# EAGLE design BQ32KSCH (EAGLE 9.2.2)
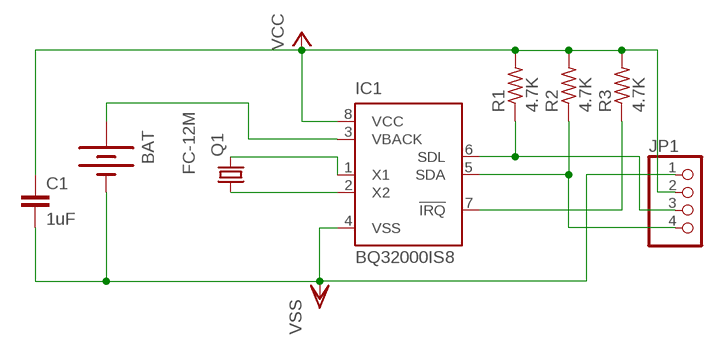
[diagram p0: schematic, sheet 1]

## Parts
BAT  CR1025-HOLDER  [CR1025-HOLDER]
C1  1uF  C-EUC3216  [C3216]
IC1  BQ32000IS8  [SO-08]
JP1  PINHD-1X4  [1X04]
Q1  FC-12M  [FC-12M]
R1  4.7K  R-US_R0402  [R0402]
R2  4.7K  R-US_R0402  [R0402]
R3  4.7K  R-US_R0402  [R0402]

## Nets
N$1: IC1.1(X1) Q1.2
N$2: IC1.2(X2) Q1.1
N$3: IC1.6(SDL) JP1.3 R1.1
N$4: IC1.5(SDA) JP1.4 R2.1
N$5: IC1.7(!IRQ) R3.1
N$6: BAT.PRWP1(PWRP) BAT.PWRP2(PWRP) IC1.3(VBACK)
VCC: C1.1 IC1.8(VCC) JP1.2 R1.2 R2.2 R3.2
VSS: BAT.PWRM1(PWRM) BAT.PWRM2(PWRM) C1.2 IC1.4(VSS) JP1.1

## Library data of the parts
BAT = CustomParts:CR1025-HOLDER
C1 = resistor:C-EU: CAPACITOR, European symbol
IC1 = CustomParts:BQ32000: 2-Wire RTC Real Time Clock/Calendar; OC_FARNELL: unknown; OC_NEWARK: unknown
JP1 = pinhead:PINHD-1X4: PIN HEADER
Q1 = crystal:FC-12M: kHz RANGE CRYSTAL UNIT LOW PROFILE SMD Source: Epson Toyocom FC-12M.pdf
R1-R3 = resistor:R-US_: RESISTOR, American symbol

## Board
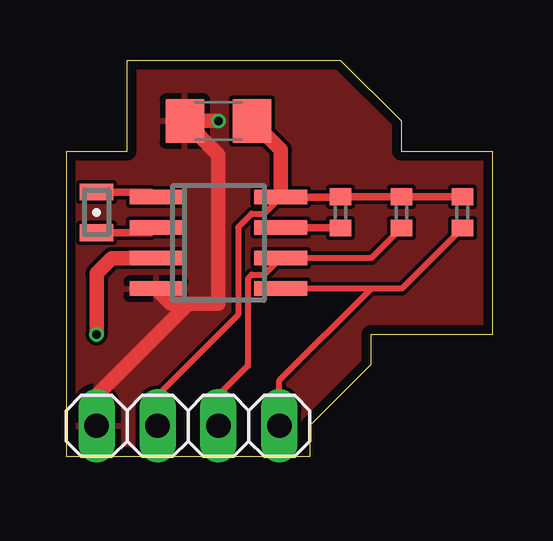
[diagram p1: board, top side]
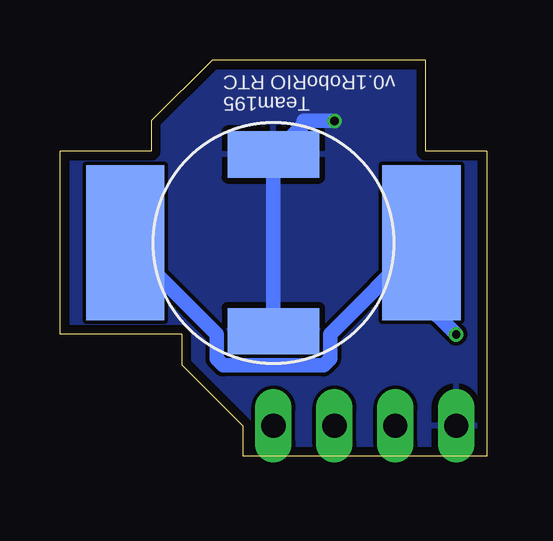
[diagram p2: board, bottom side, seen from below]

Size 17.78 x 16.51 mm. Coordinates in mm from the lower left corner, seen from the top.
Outline: 0,0 10.16,0 10.16,1.27 12.7,3.81 12.7,5.08 17.78,5.08 17.78,12.7 13.97,12.7 13.97,13.97 11.43,16.51 2.54,16.51 2.54,12.7 0,12.7 0,0
Copper layers (1*16): Top 0.035559375mm / dielectric 1.6mm / Bottom 0.035559375mm
Design rules "oshpark-2layer": minimum track width 6mil, minimum drill 10mil, track to track 6mil, track to pad 6mil, pad to pad 6mil, via to via 6mil, smd to smd 6mil, copper to edge 15mil, drill to drill 6mil, minimum pad ring 5mil, minimum via ring 5mil, stop-mask expansion 2.5mil, vias tented up to drill 0mil, thermal gap 10mil

### Footprints (pad centres in the part's own frame; a part is rotated, then mirrored left to right if it is on the bottom)
CR1025-HOLDER = smd 3.251 x 6.452: PRWP1 -6.172,0; PWRP2 6.172,0 | smd 3.81 x 1.93: PWRM1 0,3.683; PWRM2 0,-3.683
C3216 = smd 1.6 x 1.8: 1 -1.4,0; 2 1.4,0
SO-08 = smd 0.6 x 2.2: 1 -1.905,-2.6; 2 -0.635,-2.6; 3 0.635,-2.6; 4 1.905,-2.6; 5 1.905,2.6; 6 0.635,2.6; 7 -0.635,2.6; 8 -1.905,2.6
1X04 = drill 1.016 long: 1 -3.81,0; 2 -1.27,0; 3 1.27,0; 4 3.81,0
FC-12M = smd 0.7 x 1.4: 1 -0.85,0; 2 0.85,0
R0402 = smd 0.7 x 0.9: 1 -0.65,0; 2 0.65,0

### Placement (x,y rotation side)
BAT  8.89,8.89 0 bottom
C1  6.35,13.97 180 top
IC1  6.35,8.89 270 top
JP1  5.08,1.27 0 top
Q1  1.27,10.16 90 top
R1  13.97,10.16 90 top
R2  16.51,10.16 90 top
R3  11.43,10.16 90 top

### Tracks (layer width: path | path; a pad name or v marks a point on that pad's centre or on a via)
N$1
  Top 0.152: 3.54,11.01 IC1.1
  Top 0.305: Q1.2 3.54,11.01
N$2
  Top 0.152: 3.54,9.31 IC1.2
  Top 0.305: Q1.1 3.54,9.31
N$3
  Top 0.254: R1.1 12.71,8.26 IC1.6 8.26,7.56 7.73,7.56 7.57,7.4 7.57,3.76 6.35,2.54 JP1.3
N$4
  Top 0.254: R2.1 13.98,6.99 12.71,6.99 | 12.71,6.99 IC1.5 | 12.71,6.99 8.89,3.16 JP1.4
N$5
  Top 0.152: 11.41,9.53 R3.1
  Top 0.305: IC1.7 11.41,9.53
N$6  (via drill 0.35)
  Top 0.61: IC1.3 1.91,8.26 1.27,7.62 v1.27,5.08
  Bottom 0.61: v1.27,5.08 2.72,6.53 BAT.PWRP2 6.53,5.08 6.53,4.05 6.8,3.79 10.98,3.79 11.25,4.05 11.25,5.08 BAT.PRWP1
VCC
  Top 0.152: 11.41,10.79 R3.2
  Top 0.254: JP1.2 3.81,2.54 7.16,5.89 7.16,9.53 7.73,10.1 8.26,10.1 IC1.8
  Top 0.305: IC1.8 11.41,10.79 | R3.2 R1.2 R2.2
  Top 0.61: IC1.8 8.95,12.77 C1.1
VSS  (via drill 0.35)
  Top 0.61: 5.08,6.35 6.35,6.35 6.35,12.57 C1.2 v6.35,13.97 | 5.08,6.35 4.38,6.35 IC1.4 | 5.08,6.35 1.27,2.54 JP1.1
  Bottom 0.61: v6.35,13.97 7.62,13.97 7.62,13.84 BAT.PWRM1 BAT.PWRM2
  pour Top: 2.54,16.51 11.43,16.51 13.97,13.97 13.97,12.7 17.78,12.7 17.78,5.08 12.7,5.08 12.7,3.81 10.16,1.27 10.16,0 0,0 0,12.7 2.54,12.7
  pour Bottom: 2.54,16.51 11.43,16.51 13.97,13.97 13.97,12.7 17.78,12.7 17.78,5.08 12.7,5.08 12.7,3.81 10.16,1.27 10.16,0 0,0 0,12.7 2.54,12.7

### Text on the board
bPlace: v0.1 | RoboRIO RTC | Team195